# Altium project ARS_CR_LedStripModule_Rev1B.PrjPcb
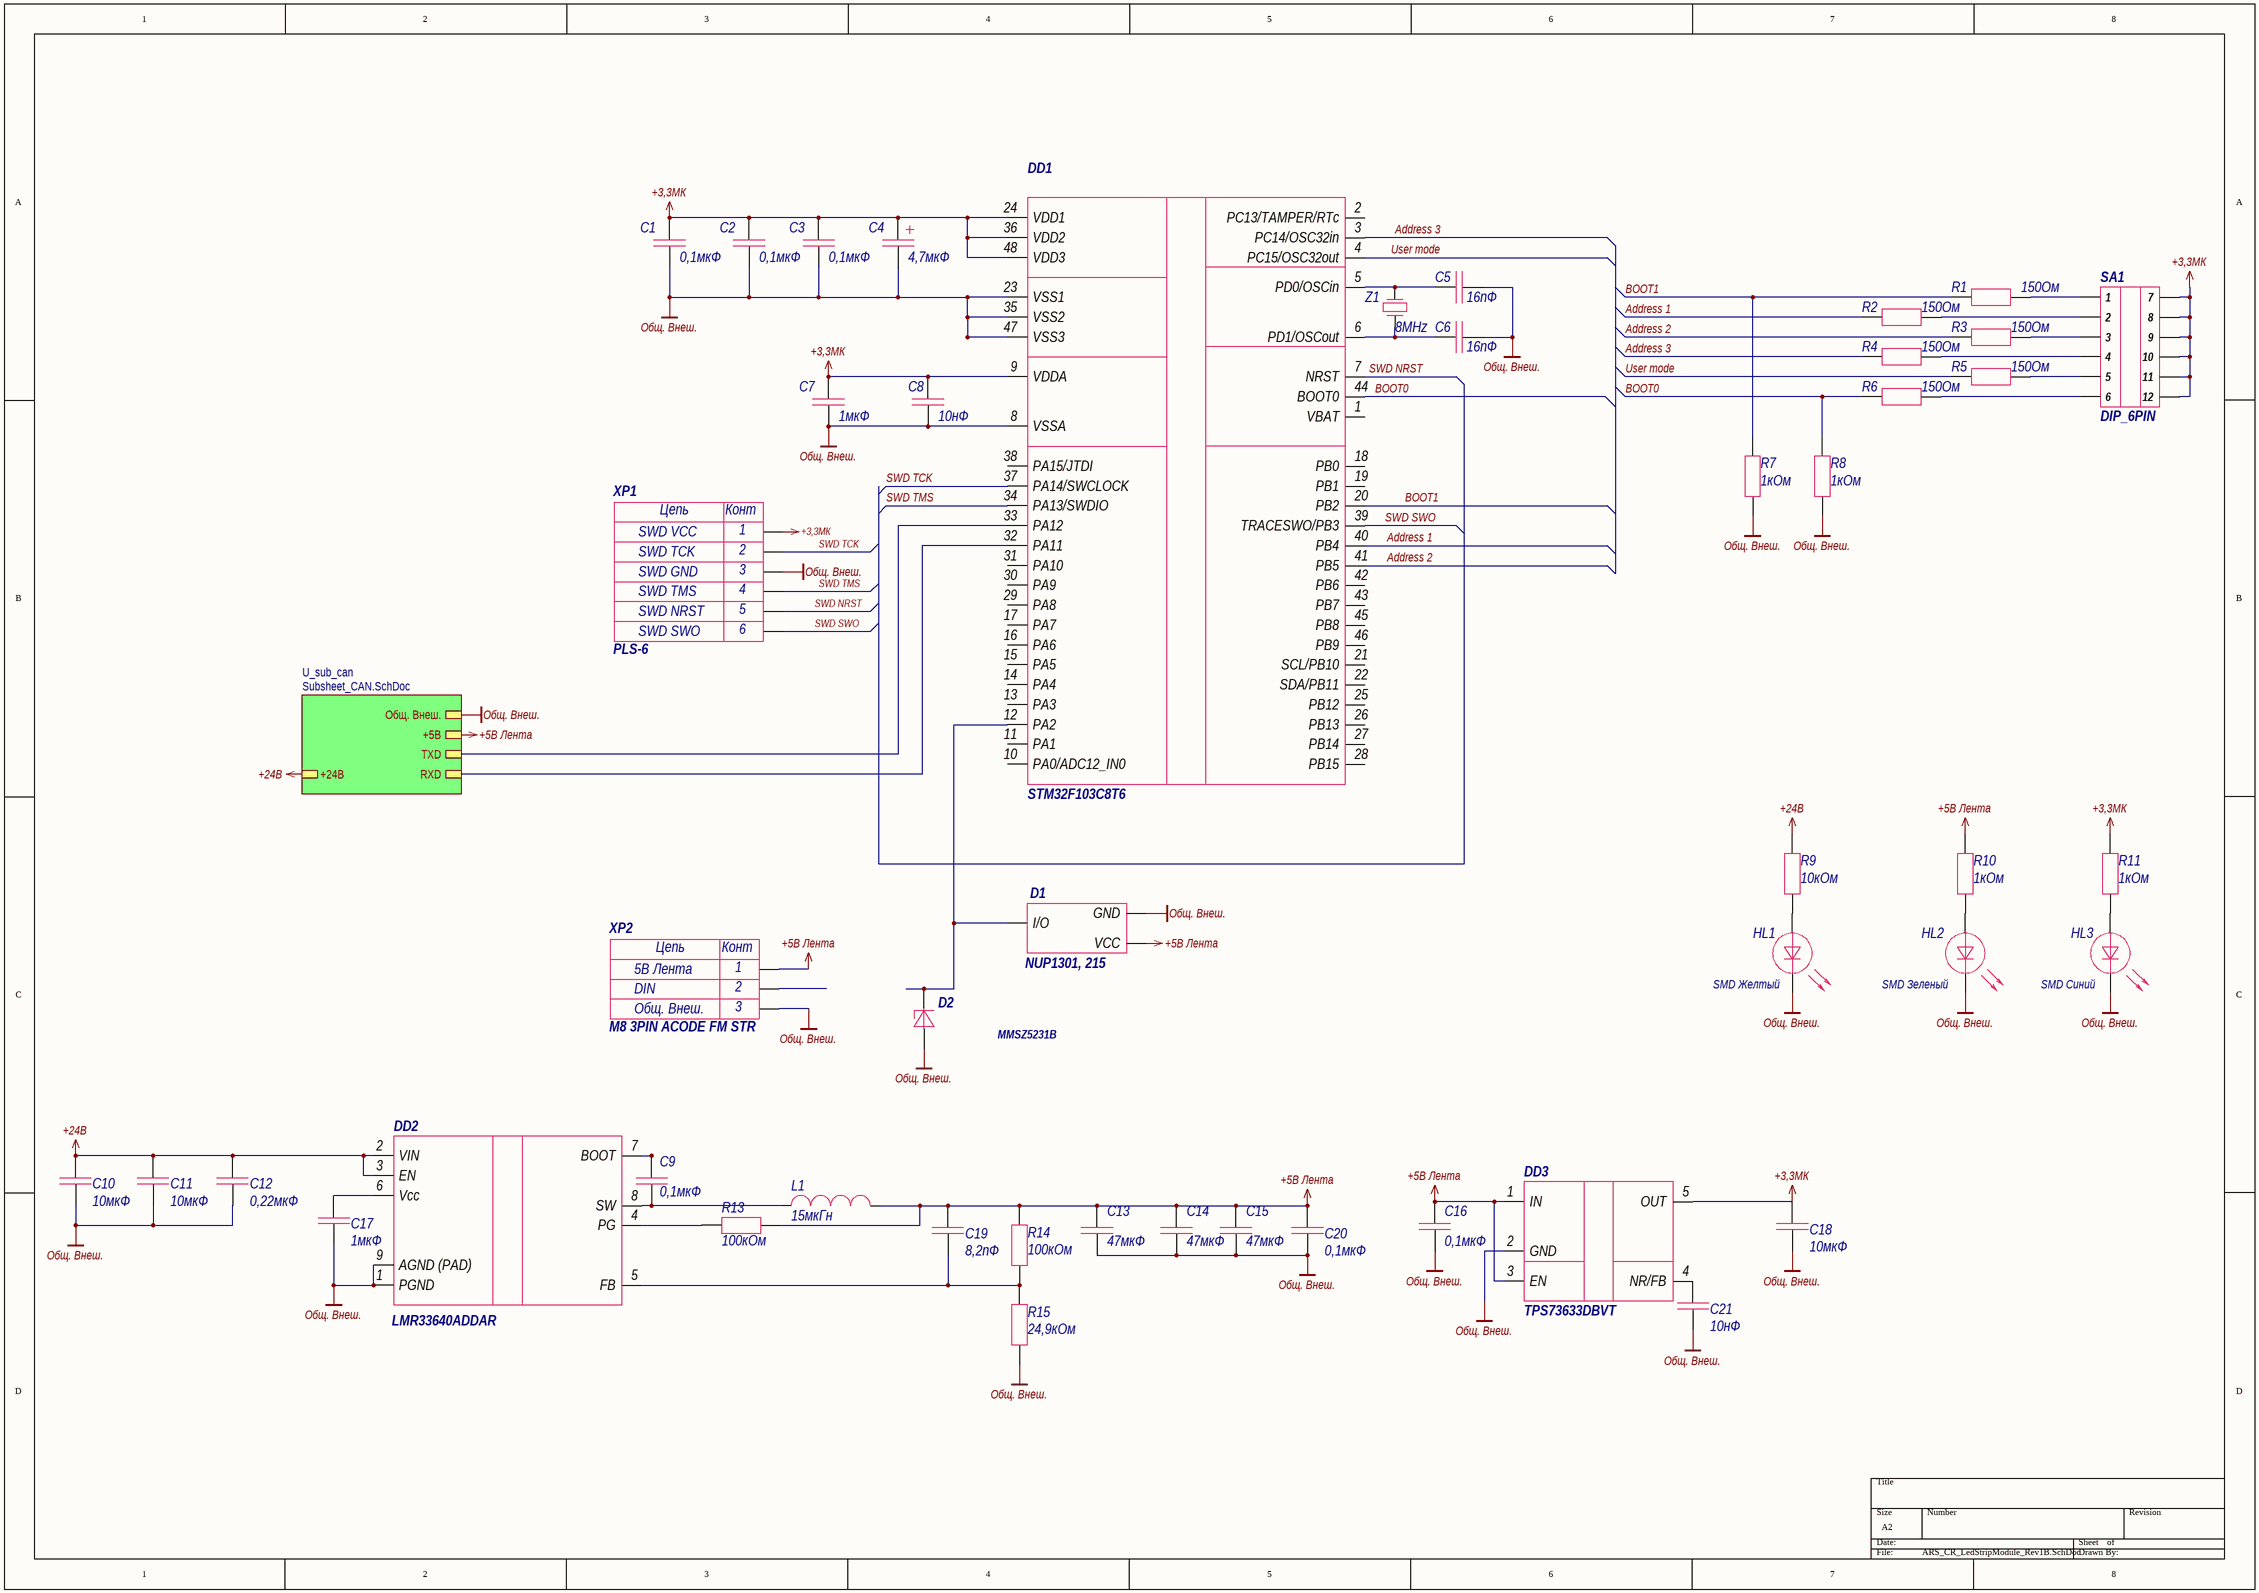
[diagram p0: ARS_CR_LedStripModule_Rev1B.SchDoc]
2 sheets, 64 parts. Net scope: hierarchical (ports join the sheet entries above them; power ports are global).
Board file: ARS_CR_LedStripModule_Rev1B.PcbDoc
Sheets:
  ARS_CR_LedStripModule_Rev1B.SchDoc
    U_sub_can = Subsheet_CAN.SchDoc

## Sheet ARS_CR_LedStripModule_Rev1B.SchDoc
size A2

### Parts
C1  value 0,1мкФ  [0603C]  (hidden comment: Capacitor)
C2  value 0,1мкФ  [0603C]  (hidden comment: Capacitor)
C3  value 0,1мкФ  [0603C]  (hidden comment: Capacitor)
C4  value 4,7мкФ  [TC_A (3216)]  (hidden comment: 1uF)
C5  value 16пФ  [0603C]  (hidden comment: Capacitor)
C6  value 16пФ  [0603C]  (hidden comment: Capacitor)
C7  value 1мкФ  [0603C]  (hidden comment: Capacitor)
C8  value 10нФ  [0603C]  (hidden comment: Capacitor)
C9  value 0,1мкФ  [0603C]  (hidden comment: Capacitor)
C10  value 10мкФ  [1210C]  (hidden comment: Capacitor)
C11  value 10мкФ  [1210C]  (hidden comment: Capacitor)
C12  value 0,22мкФ  [0603C]  (hidden comment: Capacitor)
C13  value 47мкФ  [1210C]  (hidden comment: Capacitor)
C14  value 47мкФ  [1210C]  (hidden comment: Capacitor)
C15  value 47мкФ  [1210C]  (hidden comment: Capacitor)
C16  value 0,1мкФ  [0603C]  (hidden comment: Capacitor)
C17  value 1мкФ  [0603C]  (hidden comment: Capacitor)
C18  value 10мкФ  [0805C]  (hidden comment: Capacitor)
C19  value 8,2пФ  [0603C]  (hidden comment: Capacitor)
C20  value 0,1мкФ  [0603C]  (hidden comment: Capacitor)
C21  value 10нФ  [0603C]  (hidden comment: Capacitor)
D1  NUP1301, 215  [SOT23]
D2  Zener_Diode  [SOD-123FL]  (value not drawn)
DD1  STM32F103C8T6  [LQFP48]
DD2  LMR33640ADDAR  [SOIC-9N]
DD3  TPS73633DBVT  [SOT23-5L]
HL1  SMD Желтый  [0805D]
HL2  SMD Зеленый  [0805D]
HL3  SMD Синий  [0805D]
L1  value 15мкГн  [induct_12,3x12,3x8]  (hidden comment: Inductance)
R1  value 150Ом  [0603R]  (hidden comment: Resistor)
R2  value 150Ом  [0603R]  (hidden comment: Resistor)
R3  value 150Ом  [0603R]  (hidden comment: Resistor)
R4  value 150Ом  [0603R]  (hidden comment: Resistor)
R5  value 150Ом  [0603R]  (hidden comment: Resistor)
R6  value 150Ом  [0603R]  (hidden comment: Resistor)
R7  value 1кОм  [0603R]  (hidden comment: Resistor)
R8  value 1кОм  [0603R]  (hidden comment: Resistor)
R9  value 10кОм  [0603R]  (hidden comment: Resistor)
R10  value 1кОм  [0603R]  (hidden comment: Resistor)
R11  value 1кОм  [0603R]  (hidden comment: Resistor)
R13  value 100кОм  [0603R]  (hidden comment: Resistor)
R14  value 100кОм  [0603R]  (hidden comment: Resistor)
R15  value 24,9кОм  [0603R]  (hidden comment: Resistor)
SA1  DIP_6PIN  [SW-6]
XP1  value PLS-6  Value1: SWD VCC  Value2: SWD TCK  Value3: SWD GND  Value4: SWD TMS  Value5: SWD NRST  Value6: SWD SWO  [PLS6]  (hidden comment: 6_PIN_XP)
XP2  value M8 3PIN ACODE FM STR  Value1: 5В Лента  Value2: DIN  Value3: Общ. Внеш.  [M8_ACODE_3PIN_FM_STR]  (hidden comment: 3_PIN_XP)
Z1  value 8MHz  [HC49US]  (hidden comment: XTAL)

### Sub-sheets
U_sub_can = Subsheet_CAN.SchDoc: Общ. Внеш., +5В, RXD, TXD, +24В

### Nets
+3,3МК: C1.2 C2.2 C3.2 C4.1 C7.2 C8.2 C18.2 DD1.9(VDDA) DD1.24(VDD1) DD1.36(VDD2) DD1.48(VDD3) DD3.5(OUT) R11.2 SA1.7 SA1.8 SA1.9 SA1.10 SA1.11 SA1.12 XP1.1
+5В Лента: C13.2 C14.2 C15.2 C16.2 C19.2 C20.2 D1.2(VCC) DD3.1(IN) DD3.3(EN) L1.2 R10.2 R13.2 R14.2 XP2.1 ; sheet U_sub_can/+5В  [project net +5В]
+24В: C10.2 C11.2 C12.2 DD2.2(VIN) DD2.3(EN) R9.2 ; sheet U_sub_can/+24В
Общ. Внеш.: C1.1 C2.1 C3.1 C4.2 C5.1 C6.1 C7.1 C8.1 C10.1 C11.1 C12.1 C13.1 C14.1 C15.1 C16.1 C17.1 C18.1 C20.1 C21.1 D1.1(GND) D2.1 DD1.8(VSSA) DD1.23(VSS1) DD1.35(VSS2) DD1.47(VSS3) DD2.1(PGND) DD2.9(AGND_(PAD)) DD3.2(GND) HL1.2 HL2.2 HL3.2 R7.1 R8.1 R15.1 XP1.3 XP2.3 ; sheet U_sub_can/Общ. Внеш.
Address 1: DD1.40(PB4) R2.1
Address 2: DD1.41(PB5) R3.1
Address 3: DD1.3(PC14/OSC32in) R4.1
BOOT0: DD1.44(BOOT0) R6.1 R8.2
BOOT1: DD1.20(PB2) R1.1 R7.2
SWD NRST: DD1.7(NRST) XP1.5
SWD SWO: DD1.39(TRACESWO/PB3) XP1.6
SWD TCK: DD1.37(PA14/SWCLOCK) XP1.2
SWD TMS: DD1.34(PA13/SWDIO) XP1.4
User mode: DD1.4(PC15/OSC32out) R5.1
NetC5_2: C5.2 DD1.5(PD0/OSCin) Z1.2
NetC6_2: C6.2 DD1.6(PD1/OSCout) Z1.1
NetC9_1: C9.1 DD2.8(SW) L1.1
NetC9_2: C9.2 DD2.7(BOOT)
NetC17_2: C17.2 DD2.6(Vcc)
NetC19_1: C19.1 DD2.5(FB) R14.1 R15.2
NetC21_2: C21.2 DD3.4(NR/FB)
NetD1_3: D1.3(I/O) D2.2 DD1.12(PA2)
NetDD1_32: DD1.32(PA11) ; sheet U_sub_can/RXD
NetDD1_33: DD1.33(PA12) ; sheet U_sub_can/TXD
NetDD2_4: DD2.4(PG) R13.1
NetHL1_1: HL1.1 R9.1
NetHL2_1: HL2.1 R10.1
NetHL3_1: HL3.1 R11.1
NetR1_2: R1.2 SA1.1
NetR2_2: R2.2 SA1.2
NetR3_2: R3.2 SA1.3
NetR4_2: R4.2 SA1.4
NetR5_2: R5.2 SA1.5
NetR6_2: R6.2 SA1.6

Not connected (* = marked no-connect by the designer): DD1 1(VBAT) 2(PC13/TAMPER/RTc) 10(PA0/ADC12_IN0) 11(PA1) 13(PA3) 14(PA4) 15(PA5) 16(PA6) 17(PA7) 18(PB0) 19(PB1) 21(SCL/PB10) 22(SDA/PB11) 25(PB12) 26(PB13) 27(PB14) 28(PB15) 29(PA8) 30(PA9) 31(PA10) 38(PA15/JTDI) 42(PB6) 43(PB7) 45(PB8) 46(PB9); XP2 2

### Notes on the sheet
- (near D2) MMSZ5231B
- (in symbol 8B003) Цепь; Конт
- (in symbol PLS-6) Цепь; Конт

### Library data of the parts
C1-C3 C9 C16 C20 = 06035C104KAT2A: Type: Керамический; Parameter: 50В; Tolerance: 10%; Part Name: 06035C104KAT2A; Package: 0603; Shop Link: https://www.terraelectronica.ru/product/577475
C4 = TECAP4.7/20VA, 10%: Type: Танталовый; Parameter: 20В; Tolerance: 10%; Part Name: TECAP4.7/20VA, 10%; Package: ТС_А (3216); Shop Link: https://www.terraelectronica.ru/product/874947
C5 C6 = CC0603JRNPO9BN160: Type: Керамический; Parameter: 50В; Tolerance: 5%; Part Name: CC0603JRNPO9BN160; Package: 0603; Shop Link: https://www.terraelectronica.ru/product/854177
C7 C17 = GRM188R71E105KA12D: Type: Керамический; Parameter: 25В; Tolerance: 10%; Part Name: GRM188R71E105KA12D; Package: 0603; Shop Link: https://www.terraelectronica.ru/product/351169
C8 C21 = GRM188R72A103KA01D: Type: Керамический; Parameter: 100В; Tolerance: 10%; Part Name: GRM188R72A103KA01D; Package: 0603; Shop Link: https://www.terraelectronica.ru/product/1066366
C10 C11 = C3225X7R1H106M250AC: Type: Керамический; Parameter: 50В; Tolerance: 20%; Part Name: C3225X7R1H106M250AC; Package: 1210; Shop Link: https://www.terraelectronica.ru/product/2085017
C12 = CC0603JRX7R6BB224: Type: Керамический; Parameter: 10В; Tolerance: 5%; Part Name: CC0603JRX7R6BB224; Package: 0603; Shop Link: https://www.terraelectronica.ru/product/882662
C13-C15 = GRM32ER61C476KE15L: Type: Керамический; Parameter: 16В; Tolerance: 10%; Part Name: GRM32ER61C476KE15L; Package: 1210; Shop Link: https://www.terraelectronica.ru/product/577695
C18 = GRM21BR61C106KE15L: Type: Керамический; Parameter: 16В; Tolerance: 10%; Part Name: GRM21BR61C106KE15L; Package: 0805; Shop Link: https://www.terraelectronica.ru/product/566229
C19 = CC0603CRNPO9BN8R2: Type: Керамический; Parameter: 50В; Tolerance: 3%; Part Name: CC0603CRNPO9BN8R2; Package: 0603; Shop Link: https://www.terraelectronica.ru/product/568653
D1 = NUP1301,215: TVS; Type: Защитный; Value: NUP1301, 215; Part Name: NUP1301,215; Package: SOT-23; Shop Link: https://www.terraelectronica.ru/product/1917476
D2 = MMSZ5231B: Type: Стабилитрон; Parameter: 5В; Value: MMSZ5231B; Part Name: MMSZ5231B; Package: SOD-123; Shop Link: https://elbase.ru/products/view/MMSZ5231B/
DD1 = STM32F103C8T6: STM 32-bit MCU; Manufacturer Status: Production; New: N; Min Supply Days: 11; Designer Status: Tested and Approved; ComponentLink1Description: New link; ComponentLink1URL: *; PartNumber: STM32F103C8T6; Value: STM32F103C8T6; Part Name: STM32F103C8T6; Type: Микроконтроллер; Package: LQFP48; Supplier: Терраэлектроника; Price: 1385,72; Max Supply Days: 11; Shop Link: https://www.terraelectronica.ru/product/269447
DD2 = LMR33640ADDAR: Value: 3,8... 36В; Parameter: 1... 24В ; 4А; Part Name: LMR33640ADDAR; Type: Импульсный регулятор; Package: SOIC-9N; Shop Link: https://www.elitan.ru/price/item22698913
DD3 = TPS73633DBVT: Value: 5В; Parameter: 3,3В ; 0,4А; Part Name: TPS73633DBVT; Type: Линейный регулятор; Package: SOT223; Shop Link: https://www.terraelectronica.ru/product/215389
HL1 = FYLS-0805YC: Желтый; Type: Светодиод; Value: SMD Желтый; Part Name: FYLS-0805YC; Package: 0805; Shop Link: https://www.elitan.ru/price/item12825588
HL2 = FYLS-0805PGC: Зеленый; Type: Светодиод; Value: SMD Зеленый; Part Name: FYLS-0805PGC; Package: 0805; Shop Link: https://www.terraelectronica.ru/product/600968
HL3 = TO-2013BC-BF: Синий; Type: Светодиод; Value: SMD Синий; Part Name: TO-2013BC-BF; Package: 0805; Shop Link: https://www.elitan.ru/price/item19520836
L1 = CDRH127/LDNP-150MC: Type: Индуктивность; Parameter: 5,65А; Tolerance: 20%; Part Name: CDRH127/LDNP-150MC; Package: 12.3x12.3; Shop Link: https://www.terraelectronica.ru/product/231350
R1-R6 = RC0603FR-07150RL: Tolerance: 1%; Part Name: RC0603FR-07150RL; Type: Resistor; Package: 0603R; Shop Link: https://www.terraelectronica.ru/product/823167
R7 R8 R10 R11 = RC0603JR-071KL: Tolerance: 5%; Part Name: RC0603JR-071KL; Type: Resistor; Package: 0603R; Shop Link: https://www.terraelectronica.ru/product/555273
R9 = RC0603JR-0710KL: Tolerance: 5%; Part Name: RC0603JR-0710KL; Type: Resistor; Package: 0603R; Shop Link: https://www.terraelectronica.ru/product/562124
R13 R14 = RC0603FR-07100KL: Tolerance: 1%; Part Name: RC0603FR-07100KL; Type: Resistor; Package: 0603R; Shop Link: https://www.elitan.ru/price/item617400
R15 = RC0603FR-0724K9L: Tolerance: 1%; Part Name: RC0603FR-0724K9L; Type: Resistor; Package: 0603R; Shop Link: https://www.terraelectronica.ru/product/561077
SA1 = DHN-06-T-V: SMD; Parameter: xxx; Value: SMD; Part Name: DHN-06-T-V; Type: DIP переключатель; Shop Link: https://www.chipdip.ru/product0/8004287333
XP1 = PLS-6: Male; Part Name: PLS-6; Type: Разъем; Shop Link: https://www.terraelectronica.ru/product/2259227
XP2 = 8B003: A code ; Female ; Front mount; Part Name: 8B003; Tolerance: straight; Type: Разъем; Package: M8; Parameter: Front mount
Z1 = HC49US 8.000000MHz 16pF 30ppm: Резонатор; Parameter: 16пФ; Part Name: HC49US 8.000000MHz 16pF 30ppm; Type: Резонатор; Package: HC49US; Shop Link: https://www.terraelectronica.ru/product/31625

## Sheet Subsheet_CAN.SchDoc
size A4; Organization: Altium Limited; Address1: L3, 12a Rodborough Rd; Address2: Frenchs Forest; Address3: NSW; Address4: Australia 2086
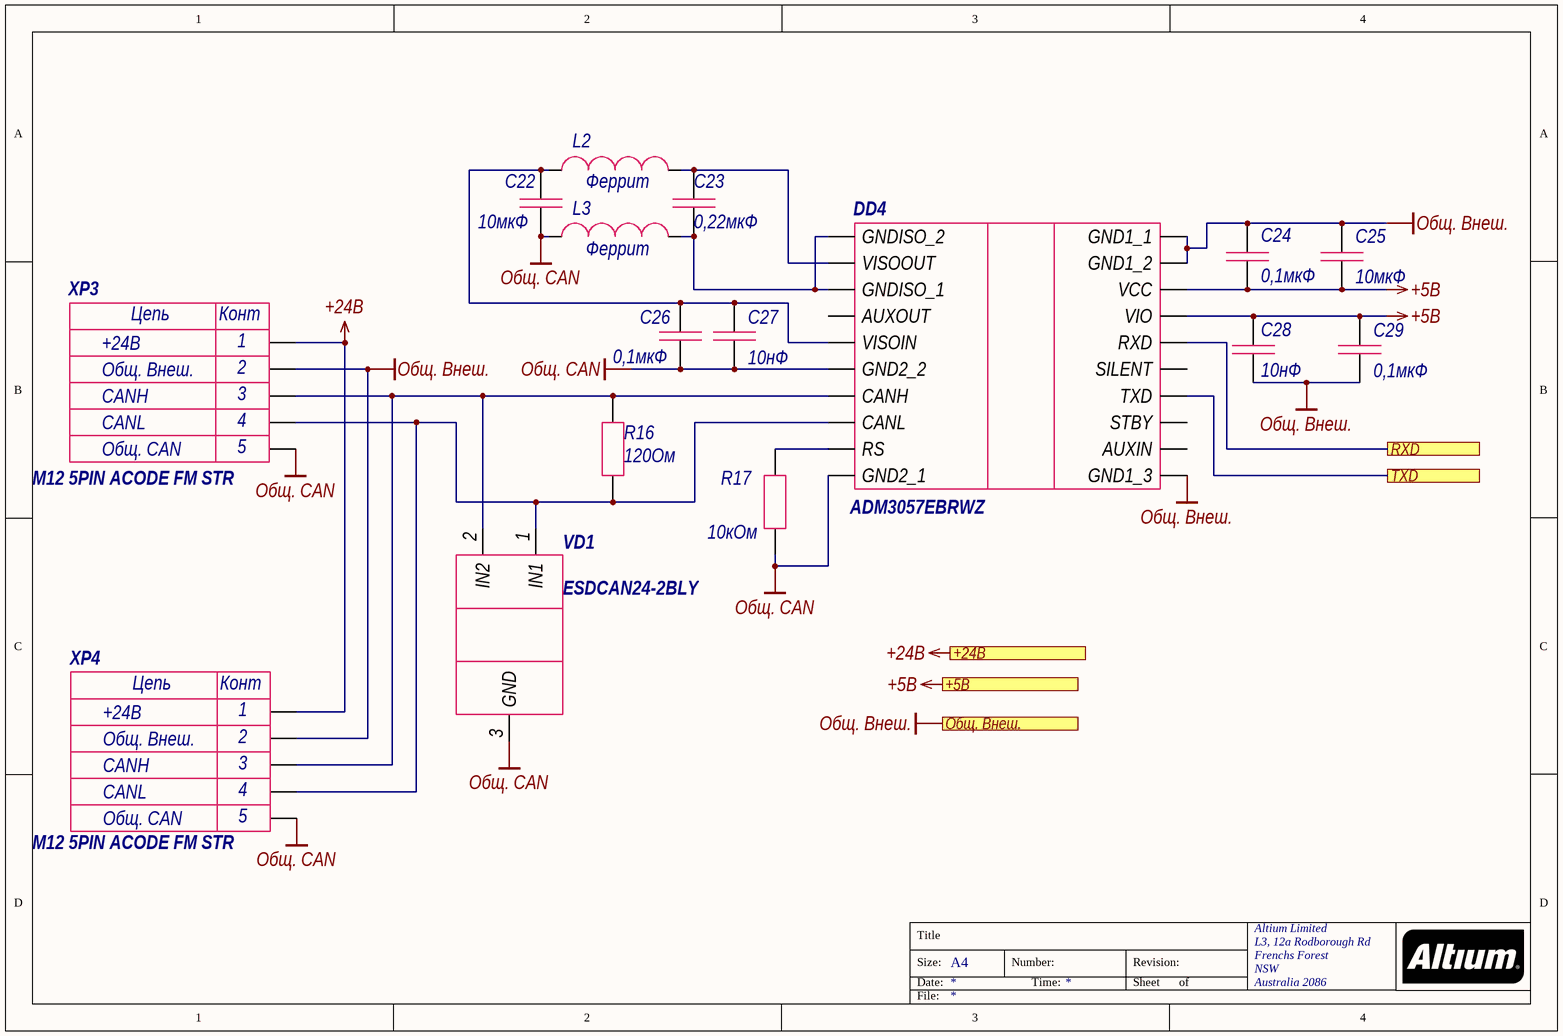
[diagram p1: Subsheet_CAN.SchDoc]

### Parts
C22  value 10мкФ  [0805C]  (hidden comment: Capacitor)
C23  value 0,22мкФ  [0603C]  (hidden comment: Capacitor)
C24  value 0,1мкФ  [0603C]  (hidden comment: Capacitor)
C25  value 10мкФ  [0805C]  (hidden comment: Capacitor)
C26  value 0,1мкФ  [0603C]  (hidden comment: Capacitor)
C27  value 10нФ  [0603C]  (hidden comment: Capacitor)
C28  value 10нФ  [0603C]  (hidden comment: Capacitor)
C29  value 0,1мкФ  [0603C]  (hidden comment: Capacitor)
DD4  ADM3057EBRWZ  [SOIC-20N]
L2  value Феррит  [0402]  (hidden comment: Inductance)
L3  value Феррит  [0402]  (hidden comment: Inductance)
R16  value 120Ом  [0603R]  (hidden comment: Resistor)
R17  value 10кОм  [0603R]  (hidden comment: Resistor)
VD1  ESDCAN24-2BLY  [SOT23-3L]
XP3  value M12 5PIN ACODE FM STR  Value1: +24В  Value2: Общ. Внеш.  Value3: CANH  Value4: CANL  Value5: Общ. CAN  [M12_ACODE_5PIN_FM_STR]  (hidden comment: 5_PIN_XP)
XP4  value M12 5PIN ACODE FM STR  Value1: +24В  Value2: Общ. Внеш.  Value3: CANH  Value4: CANL  Value5: Общ. CAN  [M12_ACODE_5PIN_FM_STR]  (hidden comment: 5_PIN_XP)

### Ports
+5В, +24В, RXD, TXD, Общ. Внеш.

### Nets
+5В: C24.1 C25.1 C28.2 C29.2 DD4.3(VCC) DD4.4(VIO) ; port +5В
+24В: XP3.1 XP4.1 ; port +24В
Общ. CAN: C22.1 C26.1 C27.1 DD4.11(GND2_1) DD4.15(GND2_2) L3.1 R17.1 VD1.3(GND) XP3.5 XP4.5
Общ. Внеш.: C24.2 C25.2 C28.1 C29.1 DD4.1(GND1_1) DD4.2(GND1_2) DD4.10(GND1_3) XP3.2 XP4.2 ; port Общ. Внеш.
NetC22_2: C22.2 C26.2 C27.2 DD4.16(VISOIN) L2.1
NetC23_1: C23.1 DD4.18(GNDISO_1) DD4.20(GNDISO_2) L3.2
NetC23_2: C23.2 DD4.19(VISOOUT) L2.2
NetDD1_32: DD4.5(RXD) ; port RXD
NetDD1_33: DD4.7(TXD) ; port TXD
NetDD4_12: DD4.12(RS) R17.2
NetDD4_13: DD4.13(CANL) R16.1 VD1.1(IN1) XP3.4 XP4.4
NetDD4_14: DD4.14(CANH) R16.2 VD1.2(IN2) XP3.3 XP4.3

Not connected (* = marked no-connect by the designer): DD4 6(SILENT) 8(STBY) 9(AUXIN) 17(AUXOUT)

### Notes on the sheet
- Title
- Size:
- Date:
- A4
- Number:
- Time:
- Revision:
- Sheet
- of
- File:
- (in symbol 12B011) Цепь; Конт

### Library data of the parts
C22 C25 = GRM21BR61C106KE15L: as C18 on sheet ARS_CR_LedStripModule_Rev1B; Part Name: GRM21BR61C106KE15L; Package: 0805; Shop Link: https://www.terraelectronica.ru/product/566229
C23 = CC0603JRX7R6BB224: as C12 on sheet ARS_CR_LedStripModule_Rev1B; Part Name: CC0603JRX7R6BB224; Package: 0603; Shop Link: https://www.terraelectronica.ru/product/882662
C24 C26 C29 = 06035C104KAT2A: as C1 on sheet ARS_CR_LedStripModule_Rev1B; Part Name: 06035C104KAT2A; Package: 0603; Shop Link: https://www.terraelectronica.ru/product/577475
C27 C28 = GRM188R72A103KA01D: as C8 on sheet ARS_CR_LedStripModule_Rev1B; Part Name: GRM188R72A103KA01D; Package: 0603; Shop Link: https://www.terraelectronica.ru/product/1066366
DD4 = ADM3057EBRWZ: CAN; Parameter: 1,7... 5,5В; Value: ADM3057EBRWZ; Part Name: ADM3057EBRWZ; Type: Изолированный приемопередатчик; Package: SOIC-20; Shop Link: https://www.elitan.ru/price/item20186299
L2 L3 = BLM15HD182SN1D: Type: Ферритовая бусина; Parameter: 1,8кОм; Part Name: BLM15HD182SN1D; Package: 0402; Shop Link: https://www.terraelectronica.ru/product/557145
R16 = RC0603JR-07120RL: Tolerance: 5%; Part Name: RC0603JR-07120RL; Type: Resistor; Package: 0603R; Shop Link: https://www.terraelectronica.ru/product/328415
R17 = RC0603JR-0710KL: Tolerance: 5%; Part Name: RC0603JR-0710KL; Type: Resistor; Package: 0603R; Shop Link: https://www.terraelectronica.ru/product/562124
VD1 = ESDCAN24-2BLY: TVS; Type: Защитный; Parameter: 40В ; 5,5А; Value: ESDCAN24-2BLY; Part Name: ESDCAN24-2BLY; Package: SOT-23-3L; Shop Link: https://www.terraelectronica.ru/product/1048813
XP3 XP4 = 12B011: A code ; Female ; Front mount; Part Name: 12B011; Tolerance: straight; Type: Разъем; Package: M12; Parameter: Front mount

## Nets that join several sheets
+5В: ARS_CR_LedStripModule_Rev1B (14 pins), Subsheet_CAN (6 pins)
+24В: ARS_CR_LedStripModule_Rev1B (6 pins), Subsheet_CAN (XP3.1 XP4.1)
Общ. Внеш.: ARS_CR_LedStripModule_Rev1B (36 pins), Subsheet_CAN (9 pins)
NetDD1_32: ARS_CR_LedStripModule_Rev1B (DD1.32), Subsheet_CAN (DD4.5)
NetDD1_33: ARS_CR_LedStripModule_Rev1B (DD1.33), Subsheet_CAN (DD4.7)